# EAGLE design mss-abs (EAGLE 5.11)
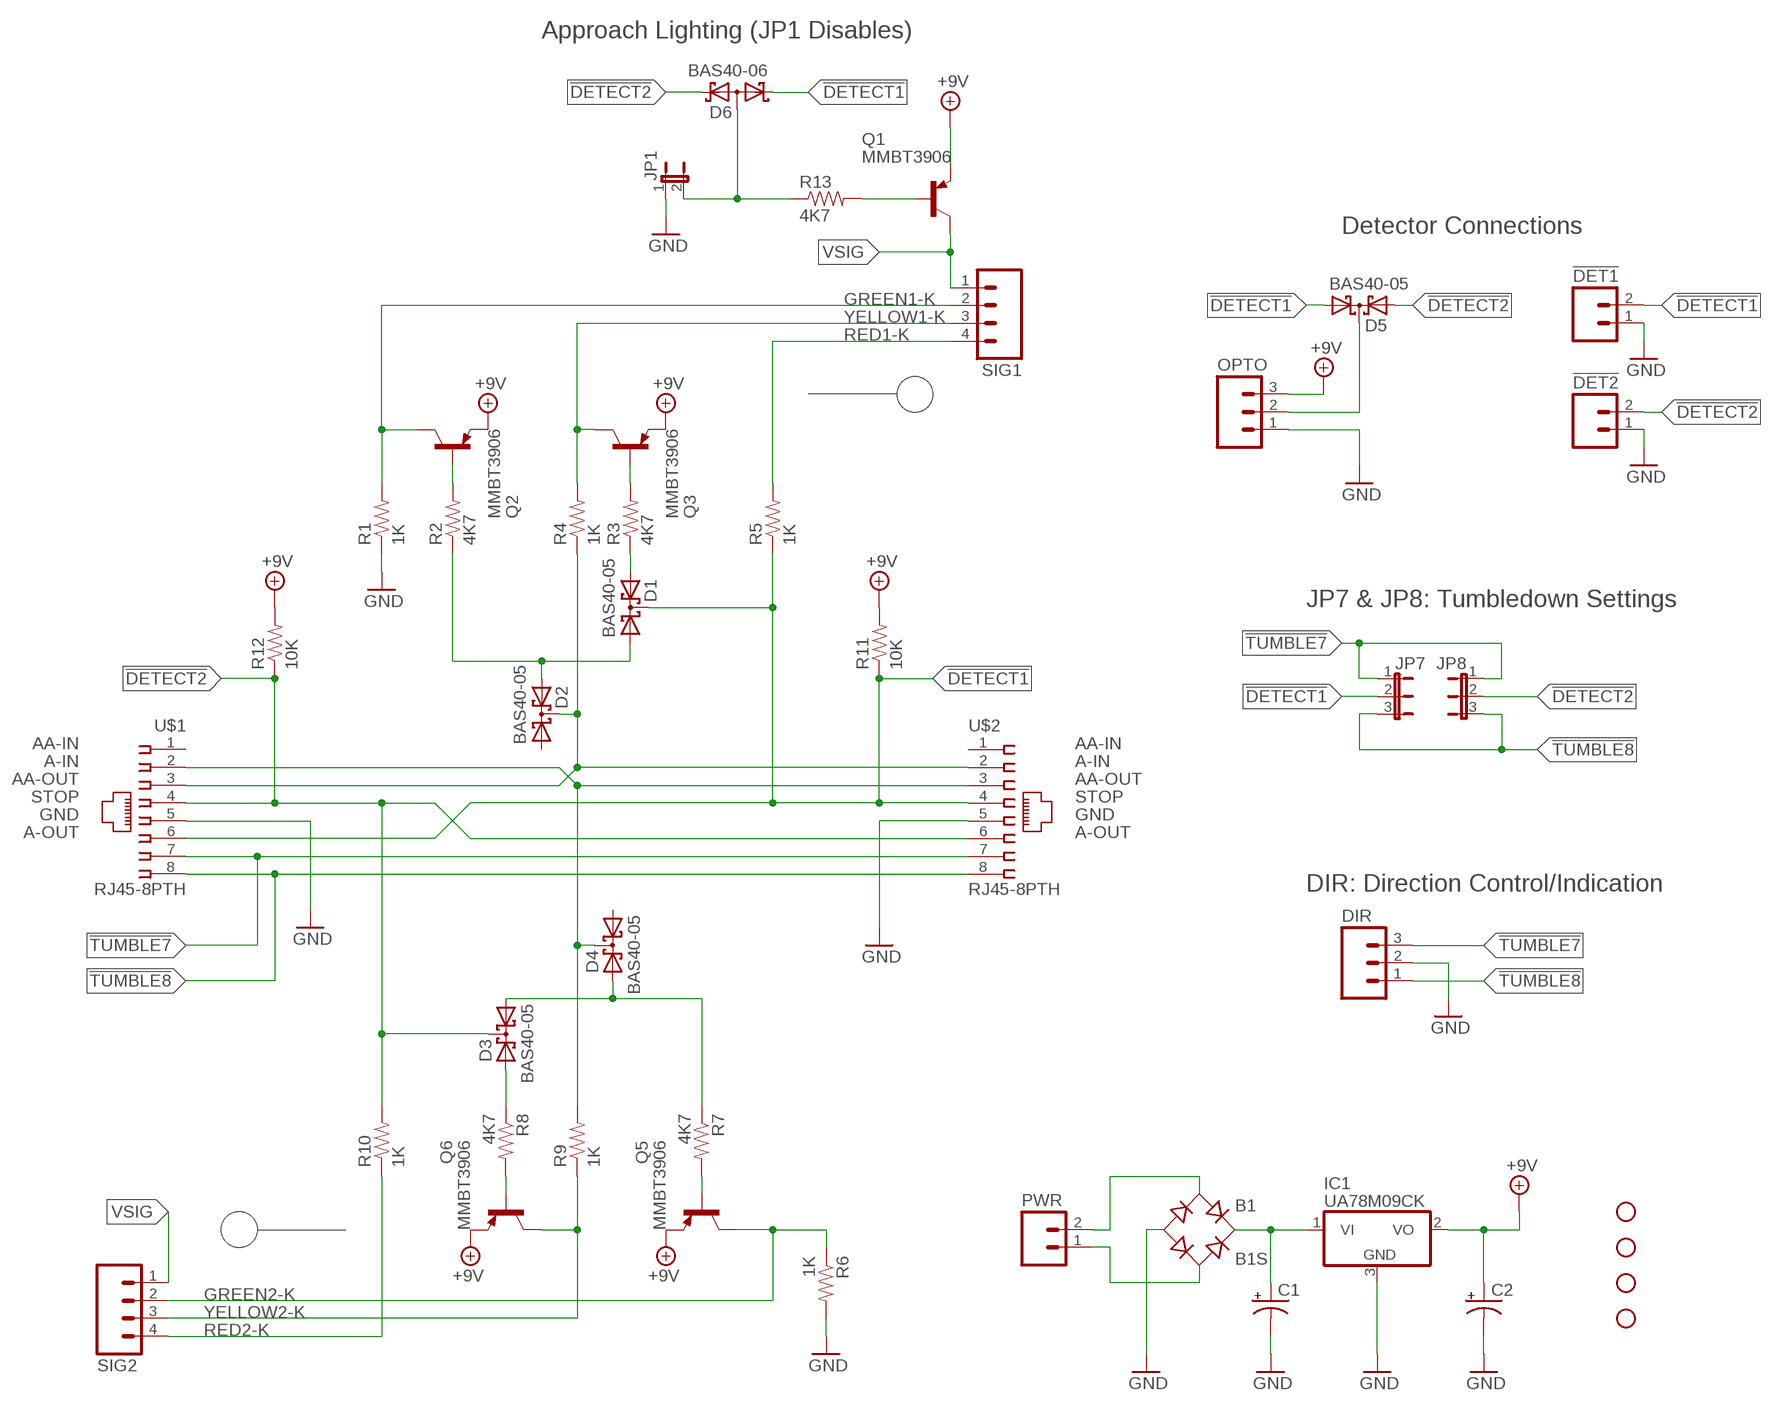
[diagram p0: schematic, sheet 1]

## Parts
!DET1  M023.5MM  [SCREWTERMINAL-3.5MM-2]
!DET2  M023.5MM  [SCREWTERMINAL-3.5MM-2]
B1  B1S  [MBS]
C1  CAP_POL1206-KIT  [EIA3216-KIT]
C2  CAP_POL1206-KIT  [EIA3216-KIT]
D1  BAS40-05  [SOT23]
D2  BAS40-05  [SOT23]
D3  BAS40-05  [SOT23]
D4  BAS40-05  [SOT23]
D5  BAS40-05  [SOT23]
D6  BAS40-06  [SOT23]
DIR  M03PTH  [1X03]
IC1  UA78M09CK  7808DT  [TO252]
JP1  JP1E  [JP1]
JP7  JP2E  [JP2]
JP8  JP2E  [JP2]
JP10  STAND-OFF  [STAND-OFF]
JP11  STAND-OFF  [STAND-OFF]
JP14  STAND-OFF  [STAND-OFF]
JP15  STAND-OFF  [STAND-OFF]
OPTO  M03SCREW  [SCREWTERMINAL-3.5MM-3]
PWR  M025MM  [SCREWTERMINAL-5MM-2]
Q1  MMBT3906  MMBT3906LT1SMD  [SOT23-BEC]
Q2  MMBT3906  MMBT3906LT1SMD  [SOT23-BEC]
Q3  MMBT3906  MMBT3906LT1SMD  [SOT23-BEC]
Q5  MMBT3906  MMBT3906LT1SMD  [SOT23-BEC]
Q6  MMBT3906  MMBT3906LT1SMD  [SOT23-BEC]
R1  1K  RESISTOR0805-RES  [0805]
R2  4K7  RESISTOR0805-RES  [0805]
R3  4K7  RESISTOR0805-RES  [0805]
R4  1K  RESISTOR0805-RES  [0805]
R5  1K  RESISTOR0805-RES  [0805]
R6  1K  RESISTOR0805-RES  [0805]
R7  4K7  RESISTOR0805-RES  [0805]
R8  4K7  RESISTOR0805-RES  [0805]
R9  1K  RESISTOR0805-RES  [0805]
R10  1K  RESISTOR0805-RES  [0805]
R11  10K  RESISTOR0805-RES  [0805]
R12  10K  RESISTOR0805-RES  [0805]
R13  4K7  RESISTOR0805-RES  [0805]
SIG1  M04SCREW  [SCREWTERMINAL-3.5MM-4]
SIG2  M04SCREW  [SCREWTERMINAL-3.5MM-4]
U$1  RJ45-8PTH  215877-4  [215877-4]
U$2  RJ45-8PTH  215877-4  [215877-4]

## Nets
!DETECT1: !DET1.2 D1.3(C) D5.1(A1) D6.1(K1) JP7.2 R5.1 R11.1 U$1.6 U$2.4
!DETECT2: !DET2.2 D3.3(C) D5.2(A2) D6.2(K2) JP8.2 R10.2 R12.1 U$1.4 U$2.6
!OPTO: D5.3(C) OPTO.2
!TUMBLE7: DIR.3 JP7.1 JP8.1 U$1.7 U$2.7
!TUMBLE8: DIR.1 JP7.3 JP8.3 U$1.8 U$2.8
+9V: C2.A(+) IC1.2(VO) OPTO.3 Q1.E Q2.E Q3.E Q5.E Q6.E R11.2 R12.2
GND: !DET1.1 !DET2.1 B1.- C1.C(-) C2.C(-) DIR.2 IC1.3(GND) JP1.1 OPTO.1 R1.1 R6.2 U$1.5 U$2.5
GREEN1-K: Q2.C R1.2 SIG1.2
GREEN2-K: Q5.C R6.1 SIG2.2
N$1: Q3.B R3.2
N$2: Q2.B R2.2
N$3: Q6.B R8.2
N$4: Q5.B R7.2
N$6: D1.1(A1) D2.2(A2) R2.1
N$7: D1.2(A2) R3.1
N$9: D3.1(A1) D4.2(A2) R7.1
N$10: D3.2(A2) R8.1
N$11: D4.3(C) R9.2 U$1.2 U$2.3
N$12: D2.3(C) R4.1 U$1.3 U$2.2
N$13: Q1.B R13.2
N$15: D6.3(AA) JP1.2 R13.1
N$18: B1.+ C1.A(+) IC1.1(VI)
N$19: B1.AC1 PWR.2
N$20: B1.AC2 PWR.1
RED1-K: R5.2 SIG1.4
RED2-K: R10.1 SIG2.4
VSIG: Q1.C SIG1.1 SIG2.1
YELLOW1-K: Q3.C R4.2 SIG1.3
YELLOW2-K: Q6.C R9.1 SIG2.3
Unconnected: D2.1(A1) D4.1(A1) U$1.1 U$2.1

## Notes on the sheet
- Approach Lighting (JP1 Disables)
- Detector Connections
- JP7 & JP8: Tumbledown Settings
- AA-IN | AA-IN
- A-IN | A-IN
- AA-OUT | AA-OUT
- STOP | STOP
- GND | GND
- A-OUT | A-OUT
- DIR: Direction Control/Indication

## Library data of the parts
!DET1 !DET2 PWR = SparkFun:M02: Header 2 Standard 2-pin 0.1" header. Use with straight break away headers (SKU : PRT-00116), right angle break away headers (PRT-00553), swiss pins (PRT-00743), machine pins (PRT-00117), and female headers (PRT-00115). Molex polarized connector foot print use with SKU : PRT-08233 with associated crimp pins and housings.
B1 = rectifier:B*S: Surface Mount Glass Passivated Bridge Rectifiers Source: Comchip Bridge Rectifiers B05S-G_B10S-G.pdf
C1 C2 = SparkFun:CAP_POL: Capacitor Polarized These are standard SMD and PTH capacitors. Normally 10uF, 47uF, and 100uF in electrolytic and tantalum varieties. Always verify the external diameter of the through hole cap, it varies with capacity, voltage, and manufacturer. The EIA devices should be standard.
D1-D5 = diode:BAS40-05: Silicon Schottky Diodes General-purpose diode for high-speed switching
D6 = diode:BAS40-06: Silicon Schottky Diodes General-purpose diode for high-speed switching
DIR OPTO = SparkFun:M03: Header 3 Standard 3-pin 0.1" header. Use with straight break away headers (SKU : PRT-00116), right angle break away headers (PRT-00553), swiss pins (PRT-00743), machine pins (PRT-00117), and female headers (PRT-00115). Molex polarized connector foot print use with SKU : PRT-08232 with associated crimp pins and housings.
IC1 = linear:78*: Positive VOLTAGE REGULATOR Source: http://cache.national.com/ds/LM/LM78L05.pdf http://www.fairchildsemi.com/ds/LM/LM7805.pdf
JP1 = jumper:JP1E: JUMPER
JP7 JP8 = jumper:JP2E: JUMPER
JP10 JP11 JP14 JP15 = SparkFun:STAND-OFF: Stand Off This is the mechanical footprint for a #4 phillips button head screw. Use the keepout ring to avoid running the screw head into surrounding components. SKU : PRT-00447
Q1-Q3 Q5 Q6 = transistor-pnp:MMBT3906*: PNP Transistror
R1-R13 = SparkFun:RESISTOR: Resistor Basic schematic elements and footprints for 0603, 1206, and PTH resistors.
SIG1 SIG2 = SparkFun:M04: Header 4 Standard 4-pin 0.1" header. Use with straight break away headers (SKU : PRT-00116), right angle break away headers (PRT-00553), swiss pins (PRT-00743), machine pins (PRT-00117), and female headers (PRT-00115). Molex polarized connector foot print use with SKU : PRT-08231 with associated crimp pins and housings. 1MM SMD Version SKU: PRT-10208
U$1 U$2 = con-amp:215877-4: AMP connector; OC_FARNELL: unknown; OC_NEWARK: unknown

## Board
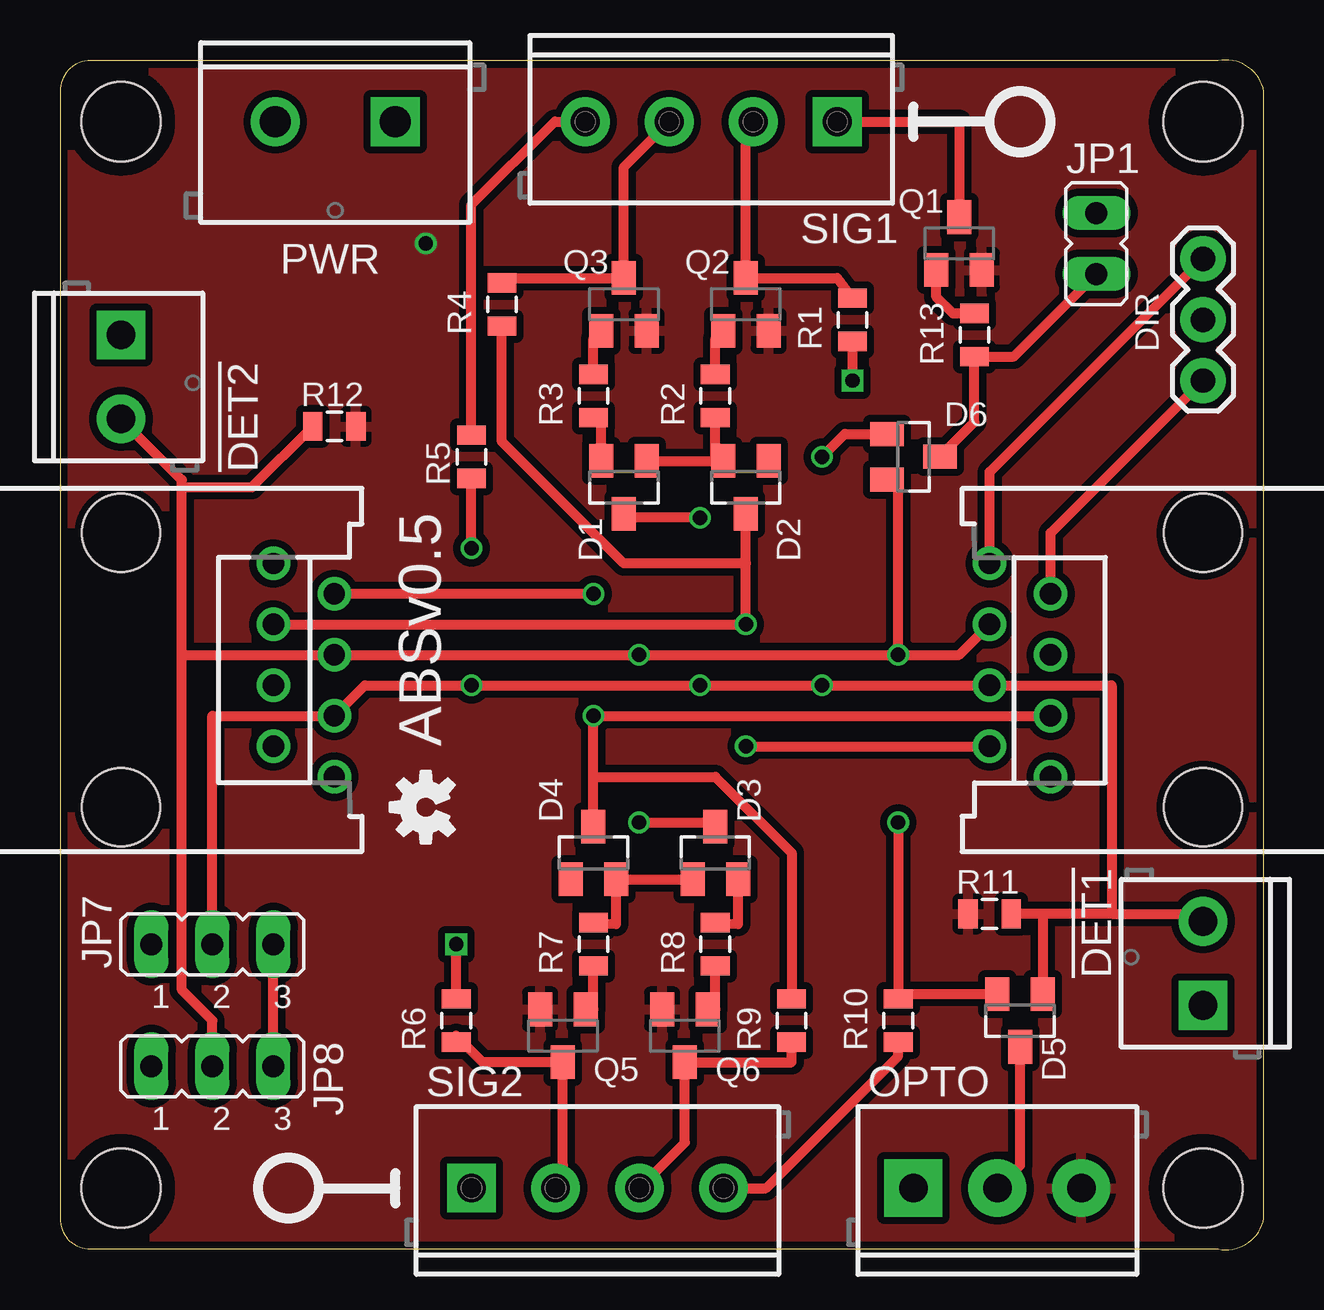
[diagram p1: board, top side]
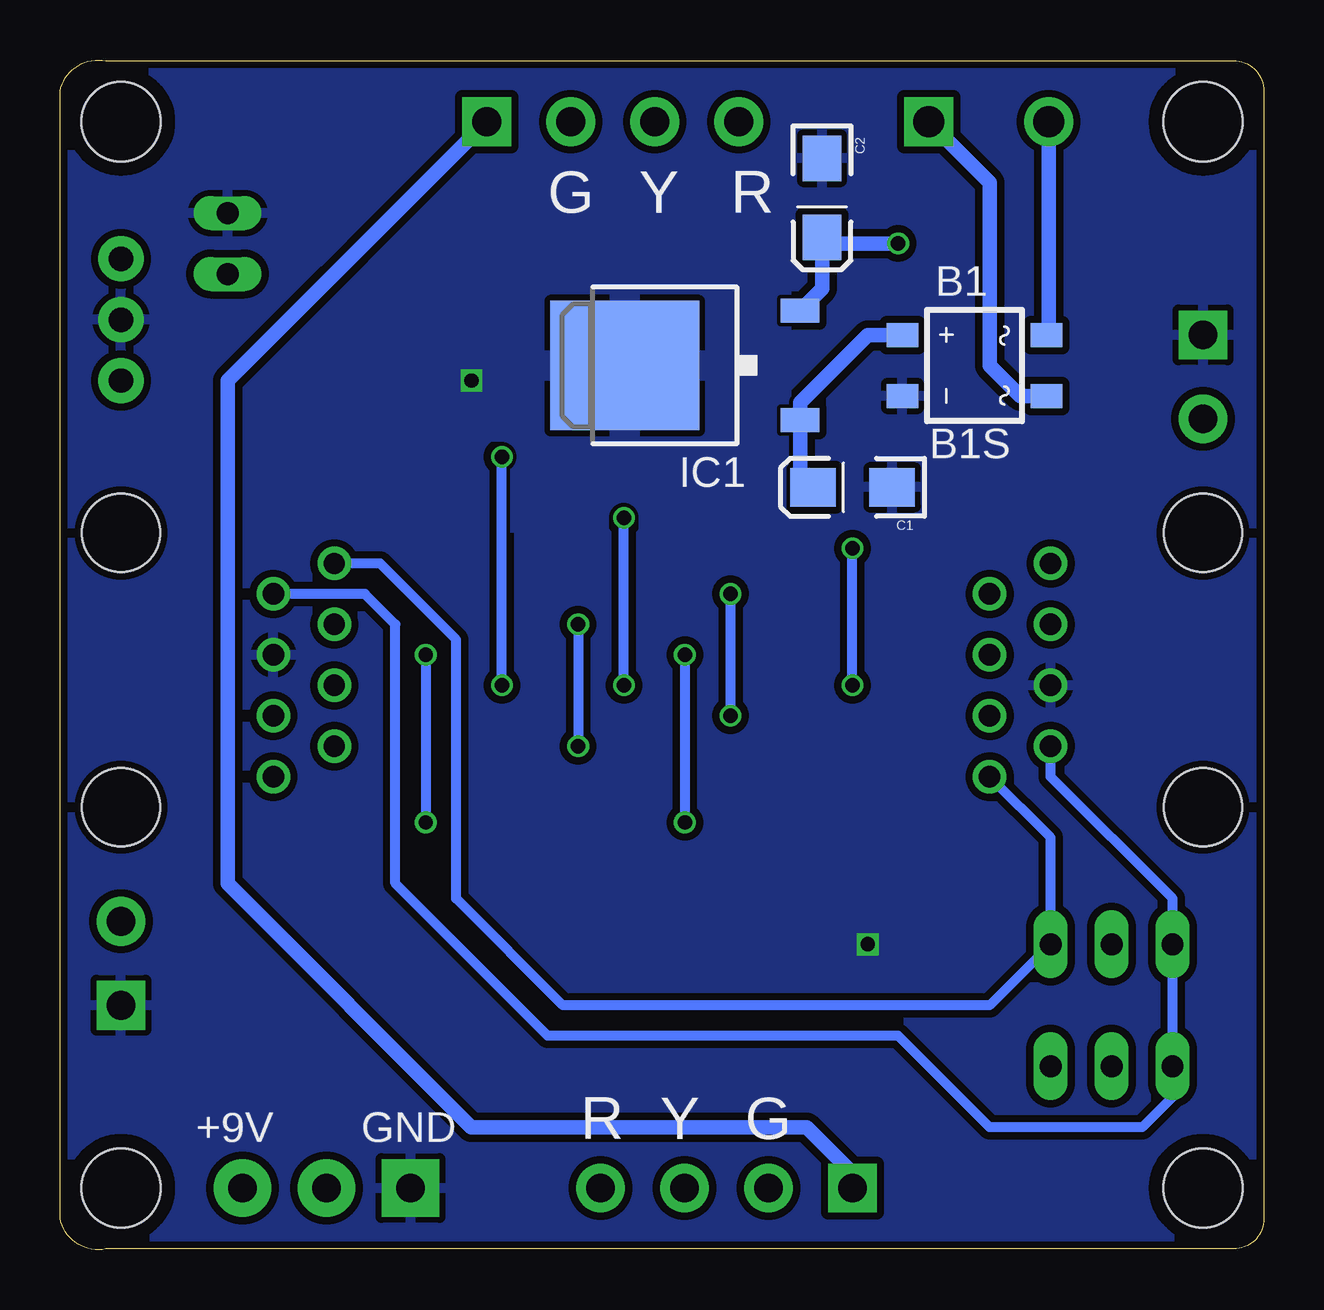
[diagram p2: board, bottom side, seen from below]

Size 50.16 x 49.59 mm. Coordinates in mm from the lower left corner, seen from the top.
Outline: 48.26,0.03 arc90 50.16,1.3 50.16,48.29 arc90 48.26,49.56 1.27,49.56 arc90 0,48.29 0,1.3 arc90 1.27,0.03 48.26,0.03
Copper layers (1*16): Top 0.035mm / dielectric 1.5mm / Bottom 0.035mm
Design rules "Fusion_eagle_rule_v1.1": minimum track width 6mil, minimum drill 12mil, track to track 6mil, track to pad 6mil, pad to pad 6mil, via to via 6mil, smd to smd 0mil, copper to edge 10mil, drill to drill 10mil, minimum pad ring 10mil, minimum via ring 6mil, stop-mask expansion 2mil, vias tented up to drill 100mil, thermal gap 10mil

### Footprints (pad centres in the part's own frame; a part is rotated, then mirrored left to right if it is on the bottom)
SCREWTERMINAL-3.5MM-2 = drill 1.2 pad 2.032 square: 1 0,0 | drill 1.2 pad 2.032 round: 2 3.5,0
MBS = smd 1 x 1.3: + -1.27,-3; - 1.27,-3; AC1 -1.27,3; AC2 1.27,3
EIA3216-KIT = smd 1.9 x 1.6: A 1.65,0; C -1.65,0
SOT23 = smd 1 x 1.4: 1 -0.95,-1.1; 2 0.95,-1.1; 3 0,1.1
1X03 = drill 1.016 pad 1.88 round: 1 0,0; 2 2.54,0; 3 5.08,0
TO252 = smd 1 x 1.6: 1 -2.28,-4.8; 2 2.28,-4.8 | smd 5.4 x 6.2: 3 0,2.5
JP1 = drill 0.914 long: 1 0,-1.27; 2 0,1.27
JP2 = drill 0.914 long: 1 -2.54,0; 2 0,0; 3 2.54,0
STAND-OFF = hole 3.302: 0,0
SCREWTERMINAL-3.5MM-3 = drill 1.2 pad 2.413 square: 1 0,0 | drill 1.2 pad 2.413 round: 2 3.5,0; 3 7,0
SCREWTERMINAL-5MM-2 = drill 1.3 pad 2.032 square: 1 0,0 | drill 1.3 pad 2.032 round: 2 5,0
SOT23-BEC = smd 1 x 1.4: B -0.95,-1.1; C 0,1.1; E 0.95,-1.1
0805 = smd 0.8 x 1.2: 1 -0.9,0; 2 0.9,0
SCREWTERMINAL-3.5MM-4 = drill 1.2 pad 2.032 square: 1 0,0 | drill 1.2 pad 2.032 round: 2 3.5,0; 3 7,0; 4 10.5,0
215877-4 = drill 0.889 round: 1 -4.445,6.35; 2 -3.175,8.89; 3 -1.905,6.35; 4 -0.635,8.89; 5 0.635,6.35; 6 1.905,8.89; 7 3.175,6.35; 8 4.445,8.89 | hole 3.251: -5.715,0; 5.715,0

### Placement (x,y rotation side)
!DET1  47.62,10.19 90 top
!DET2  2.54,38.13 270 top
B1  12.06,36.86 270 bottom
C1  17.14,31.78 180 bottom
C2  18.41,43.85 270 bottom
D1  23.5,31.78 180 top
D2  28.57,31.78 180 top
D3  27.3,16.54 0 top
D4  22.23,16.54 0 top
D5  40.01,9.56 180 top
D6  35.56,33.05 270 top
DIR  47.62,41.31 270 top
IC1  24.13,36.86 90 bottom
JP1  43.18,41.94 180 top
JP7  6.35,12.73 0 top
JP8  6.35,7.65 0 top
JP10  47.62,2.57 0 top
JP11  2.54,47.02 0 top
JP14  2.54,2.57 0 top
JP15  47.62,47.02 0 top
OPTO  35.56,2.57 0 top
PWR  13.97,47.02 180 top
Q1  37.47,41.94 0 top
Q2  28.57,39.4 0 top
Q3  23.5,39.4 0 top
Q5  20.95,8.92 180 top
Q6  26.04,8.92 180 top
R1  33.02,38.77 90 top
R2  27.3,35.59 90 top
R3  22.23,35.59 90 top
R4  18.41,39.4 90 top
R5  17.14,33.05 90 top
R6  16.51,9.56 90 top
R7  22.23,12.73 270 top
R8  27.3,12.73 270 top
R9  30.48,9.56 90 top
R10  34.92,9.56 90 top
R11  38.73,14 180 top
R12  11.43,34.32 0 top
R13  38.1,38.13 90 top
SIG1  32.38,47.02 180 top
SIG2  17.14,2.57 0 top
U$1  2.54,24.16 270 top
U$2  47.62,24.16 90 top
U$3  [OSHW-LOGO-S]  15.24,18.45 90 top

### Tracks (layer width: path | path; a pad name or v marks a point on that pad's centre or on a via)
!DETECT1  (via drill 0.6)
  Top 0.406: 43.81,14 43.81,23.53 U$2.4 v31.75,23.53 v26.67,23.53 v17.14,23.53 12.7,23.53 U$1.6 6.35,22.26 JP7.2 | 40.95,14 R11.1 | 43.81,14 47.31,14 !DET1.2 | v17.14,29.24 R5.1 | D1.3 23.66,30.51 v26.67,30.51 | 40.95,14 D5.1 | 43.81,14 40.95,14 | D6.1 32.7,34 v31.75,33.05
  Bottom 0.406: v26.67,23.53 v26.67,30.51 | v17.14,23.53 v17.14,29.24 | v31.75,23.53 v31.75,33.05
!DETECT2  (via drill 0.6)
  Top 0.406: v34.92,24.8 v24.13,24.8 U$1.4 5.08,24.8 | v34.92,24.8 37.47,24.8 U$2.6 | JP8.2 6.35,9.56 5.08,10.83 5.08,24.8 | v34.92,17.81 R10.2 34.92,10.66 D5.2 | D3.3 27.14,17.81 v24.13,17.81 | D6.2 34.92,31.64 v34.92,24.8 | !DET2.2 5.08,32.09 5.08,31.78 | 5.08,24.8 5.08,31.78 | R12.1 7.99,31.78 5.08,31.78
  Bottom 0.406: v24.13,24.8 v24.13,17.81 | v34.92,24.8 v34.92,17.81
!OPTO
  Top 0.406: D5.3 40.01,3.52 OPTO.2
!TUMBLE7
  Top 0.406: U$2.7 41.27,29.88 DIR.3
  Bottom 0.406: U$1.7 8.89,19.72 3.81,14.64 JP7.1 JP8.1 3.81,6.38 5.08,5.11 11.43,5.11 15.24,8.92 29.84,8.92 36.2,15.27 36.2,26.07 37.47,27.34 U$2.7
!TUMBLE8
  Top 0.406: JP8.3 JP7.3 | U$2.8 38.73,32.42 DIR.1
  Bottom 0.406: U$1.8 8.89,17.18 JP7.3 11.43,10.19 29.21,10.19 33.66,14.64 33.66,25.43 36.83,28.61 U$2.8
+9V  (via drill 0.6)
  Bottom 0.61: IC1.2 18.41,40.06 18.41,41.94 | 18.41,41.94 C2.A | 18.41,41.94 v15.24,41.94
  pour Top (isolate 0.305): 0,0.03 0,49.56 50.16,49.56 50.16,0.03
GND  (via drill 0.6)
  Top 0.406: R6.2 v16.51,12.73 | R1.1 v33.02,36.23
  pour Bottom (isolate 0.305): 0,0.03 0,49.56 20.32,49.56 20.32,30.51 39.37,30.51 39.37,49.56 50.16,49.56 50.16,0.03
  pour Bottom: 20.32,43.21 31.75,43.21 31.75,30.51 20.32,30.51
  pour Bottom (isolate 0.305): 19.05,49.56 39.37,49.56 39.37,30.51 19.05,30.51
GREEN1-K
  Top 0.406: R1.2 32.38,40.5 Q2.C 28.57,46.06 SIG1.2
GREEN2-K
  Top 0.406: SIG2.2 20.95,3.53 Q5.C 17.61,7.82 16.51,8.92 R6.1
N$1
  Top 0.406: R3.2 22.23,37.98 Q3.B
N$2
  Top 0.406: R2.2 27.3,37.98 Q2.B
N$3
  Top 0.406: R8.2 27.3,10.02 Q6.B
N$4
  Top 0.406: R7.2 22.23,10.02 Q5.B
N$6
  Top 0.406: D1.1 D2.2 27.3,32.88 R2.1
N$7
  Top 0.406: D1.2 22.55,34.37 R3.1
N$9
  Top 0.406: D3.1 D4.2 23.18,13.58 R7.1
N$10
  Top 0.406: D3.2 28.25,13.58 R8.1
N$11  (via drill 0.6)
  Top 0.406: v22.23,27.34 U$1.2 | U$2.3 v22.23,22.26 22.23,19.72 | D4.3 22.23,19.72 | R9.2 30.48,16.54 27.3,19.72 22.23,19.72
  Bottom 0.406: v22.23,22.26 v22.23,27.34
N$12  (via drill 0.6)
  Top 0.406: U$1.3 v28.57,26.07 28.57,28.61 | v28.57,20.99 U$2.2 | 28.57,28.61 D2.3 | R4.1 18.41,33.69 23.5,28.61 28.57,28.61
  Bottom 0.406: v28.57,26.07 v28.57,20.99
N$13
  Top 0.406: R13.2 37.2,39.03 36.52,39.72 Q1.B
N$15
  Top 0.406: D6.3 38.1,34.49 R13.1 39.74,37.23 JP1.2
N$18
  Bottom 0.61: B1.+ 16.51,38.13 19.33,35.31 IC1.1 19.33,32.32 C1.A
N$19
  Bottom 0.61: B1.AC1 8.97,38.23 PWR.2
N$20
  Bottom 0.61: B1.AC2 10.16,35.59 11.43,36.86 11.43,44.48 PWR.1
RED1-K
  Top 0.406: R5.2 17.14,43.55 20.61,47.02 SIG1.4
RED2-K
  Top 0.406: SIG2.4 29.43,2.57 34.92,8.07 R10.1
VSIG
  Top 0.406: SIG1.1 37.47,47.02 Q1.C
  Bottom 0.61: SIG2.1 17.14,3.21 19.05,5.11 33.02,5.11 43.18,15.27 43.18,36.23 SIG1.1
YELLOW1-K
  Top 0.406: SIG1.3 23.5,45.13 Q3.C 18.41,40.5 R4.2
YELLOW2-K
  Top 0.406: SIG2.3 26.04,4.46 Q6.C 30.48,7.82 R9.1

### Text on the board
tPlace: ABSv0.5
bPlace: R | Y | G | G | Y | R | GND | +9V